# EAGLE schematic esp32_artnet_pinball (EAGLE 9.6.0)
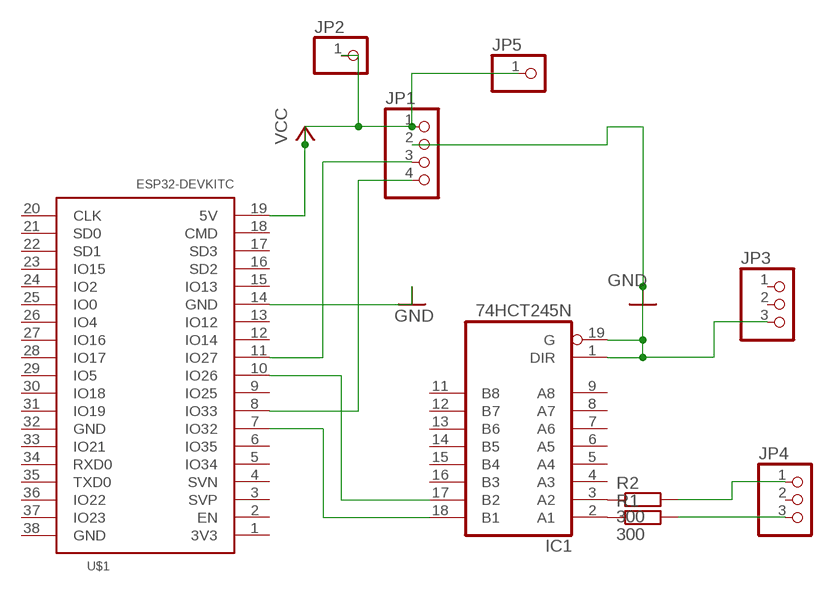
[diagram p0: schematic, sheet 1]

## Parts
IC1  74HCT245N  [DIL20]
JP1  PINHD-1X4  [1X04]
JP2  PINHD-1X1  [1X01]
JP3  PINHD-1X3  [1X03]
JP4  PINHD-1X3  [1X03]
JP5  PINHD-1X1  [1X01]
R1  300  R-EU_R1206  [R1206]
R2  300  R-EU_R1206  [R1206]
U$1  ESP32DEVKITC  [ESP32-DEVKITC]

## Nets
GND: IC1.1(DIR) IC1.19(G) JP1.2 JP3.3 U$1.14(GND)
N$1: IC1.2(A1) R1.1
N$2: IC1.3(A2) R2.1
N$3: IC1.17(B2) U$1.10(IO26)
N$4: IC1.18(B1) U$1.7(IO32)
N$5: JP4.3 R1.2
N$6: JP4.1 R2.2
N$10: JP1.4 U$1.8(IO33)
N$11: JP1.3 U$1.11(IO27)
VCC: JP1.1 JP2.1 JP5.1 U$1.19(5V)
Unconnected: IC1.4(A3) IC1.5(A4) IC1.6(A5) IC1.7(A6) IC1.8(A7) IC1.9(A8) IC1.11(B8) IC1.12(B7) IC1.13(B6) IC1.14(B5) IC1.15(B4) IC1.16(B3) JP3.1 JP3.2 JP4.2 U$1.1(3V3) U$1.2(EN) U$1.3(SVP) U$1.4(SVN) U$1.5(IO34) U$1.6(IO35) U$1.9(IO25) U$1.12(IO14) U$1.13(IO12) U$1.15(IO13) U$1.16(SD2) U$1.17(SD3) U$1.18(CMD) U$1.20(CLK) U$1.21(SD0) U$1.22(SD1) U$1.23(IO15) U$1.24(IO2) U$1.25(IO0) U$1.26(IO4) U$1.27(IO16) U$1.28(IO17) U$1.29(IO5) U$1.30(IO18) U$1.31(IO19) U$1.32(GND) U$1.33(IO21) U$1.34(RXD0) U$1.35(TXD0) U$1.36(IO22) U$1.37(IO23) U$1.38(GND)

## Power pins joined to a net without a drawn wire
GND: IC1.10(GND)
VCC: IC1.20(VCC)

## Library data of the parts
IC1 = 74xx-eu:74*245: Octal BUS TRANSCEIVER, 3-state
JP1 = pinhead:PINHD-1X4: PIN HEADER
JP2 JP5 = pinhead:PINHD-1X1: PIN HEADER
JP3 JP4 = pinhead:PINHD-1X3: PIN HEADER
R1 R2 = rcl:R-EU_: RESISTOR, European symbol; SPICEPREFIX: R
U$1 = ESP32-DEVKITC:ESP32DEVKITC